# EAGLE design controller_board (EAGLE 7.1.0)
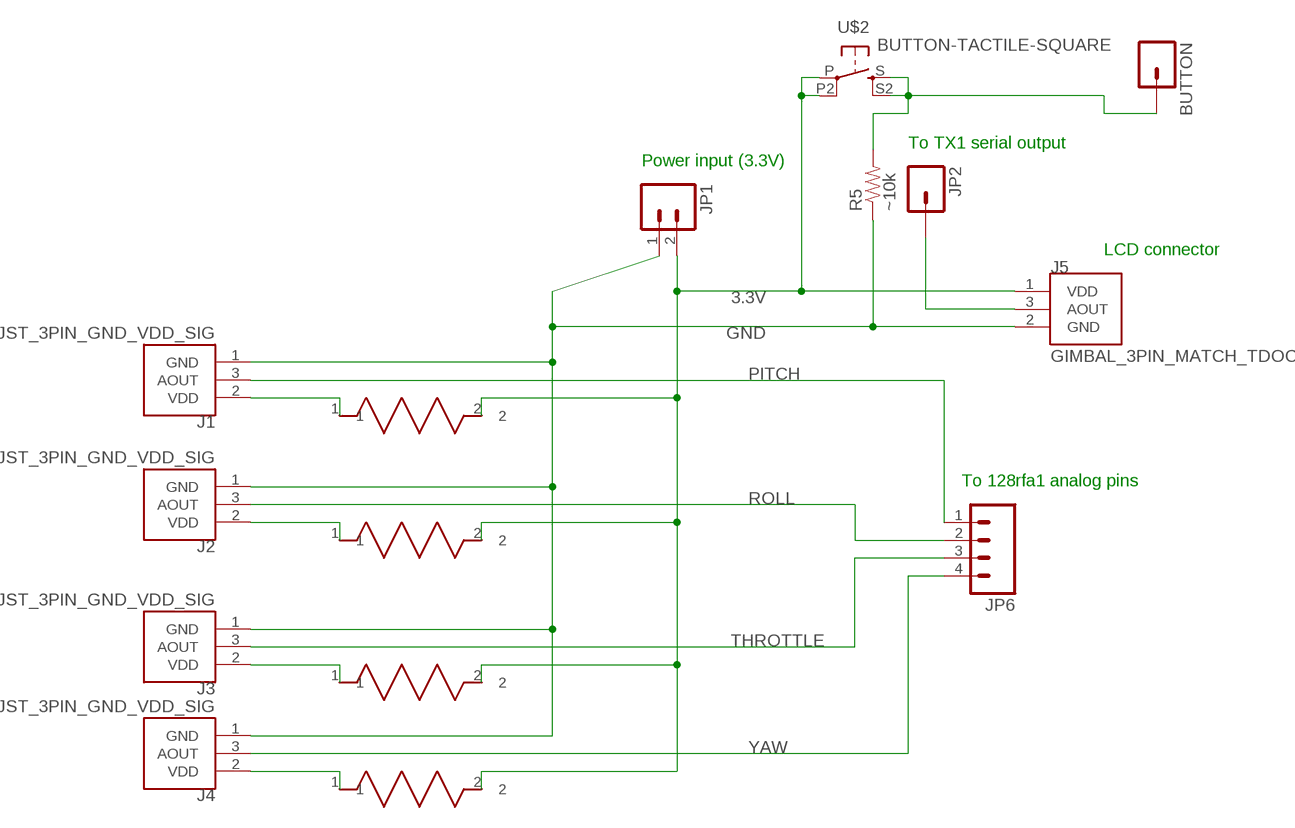
[diagram p0: schematic, sheet 1]

## Parts
BUTTON  M01PTH  [1X01]
J1  JST_3PIN_GND_VDD_SIG  [JST-3-PTH-REVERSE]
J2  JST_3PIN_GND_VDD_SIG  [JST-3-PTH-REVERSE]
J3  JST_3PIN_GND_VDD_SIG  [JST-3-PTH-REVERSE]
J4  JST_3PIN_GND_VDD_SIG  [JST-3-PTH-REVERSE]
J5  GIMBAL_3PIN_MATCH_TDOCU  [JST-3-PTH]
JP1  M021X02_NO_SILK  [1X02_NO_SILK]
JP2  M01PTH  [1X01]
JP6  M04PTH  [1X04]
PITCH  2.5k  RES_CRF12  [RES_CRF12]
R5  ~10k  RESISTORPTH-1/4W  [AXIAL-0.4]
ROLL  2.5k  RES_CRF12  [RES_CRF12]
THROTTLE  2.5k  RES_CRF12  [RES_CRF12]
U$2  BUTTON-TACTILE-SQUARE  [BUTTON-TACTILE-SQUARE-ADAFRUIT1010]
YAW  2.5k  RES_CRF12  [RES_CRF12]

## Nets
3.3V: J5.1(VDD) JP1.2 PITCH.2 ROLL.2 THROTTLE.2 U$2.P U$2.P2(P1) YAW.2
GND: J1.1(GND) J2.1(GND) J3.1(GND) J4.1(GND) J5.2(GND) JP1.1 R5.P$1
N$1: J1.2(VDD) PITCH.1
N$3: J2.2(VDD) ROLL.1
N$4: J3.2(VDD) THROTTLE.1
N$5: J4.2(VDD) YAW.1
N$6: BUTTON.1 R5.P$2 U$2.S U$2.S2(S1)
N$9: J5.3(AOUT) JP2.1
PITCH: J1.3(AOUT) JP6.1
ROLL: J2.3(AOUT) JP6.2
THROTTLE: J3.3(AOUT) JP6.3
YAW: J4.3(AOUT) JP6.4

## Notes on the sheet
- To TX1 serial output
- Power input (3.3V)
- LCD connector
- To 128rfa1 analog pins

## Library data of the parts
BUTTON JP2 = SparkFun-Connectors:M01: Header 1 Standard 1-pin 0.1" header. Use with straight break away headers (SKU : PRT-00116), right angle break away headers (PRT-00553), swiss pins (PRT-00743), machine pins (PRT-00117), and female headers (PRT-00115).
J1-J4 = Controller:JST_3PIN_GND_VDD_SIG
J5 = Controller:GIMBAL_3PIN_MATCH_TDOCU
JP1 = SparkFun-Connectors:M02: Standard 2-pin 0.1" header. Use with - straight break away headers ( PRT-00116) - right angle break away headers (PRT-00553) - swiss pins (PRT-00743) - machine pins (PRT-00117) - female headers (PRT-00115) Molex polarized connector foot print use with: PRT-08233 with associated crimp pins and housings. 2.54_SCREWTERM for use with PRT-10571. 3.5mm Screw Terminal footprints for PRT-08084 5mm Screw Terminal footprints for use with PRT-08432
JP6 = SparkFun-Connectors:M04: Header 4 Standard 4-pin 0.1" header. Use with straight break away headers (SKU : PRT-00116), right angle break away headers (PRT-00553), swiss pins (PRT-00743), machine pins (PRT-00117), and female headers (PRT-00115). Molex polarized connector foot print use with SKU : PRT-08231 with associated crimp pins and housings. 1MM SMD Version SKU: PRT-10208
PITCH ROLL THROTTLE YAW = RyanCollins_Lab4:RES_CRF12
R5 = SparkFun-Resistors:RESISTOR: Resistor Basic schematic elements and footprints for 0603, 1206, and PTH resistors.
U$2 = Controller:BUTTON-TACTILE

## Board
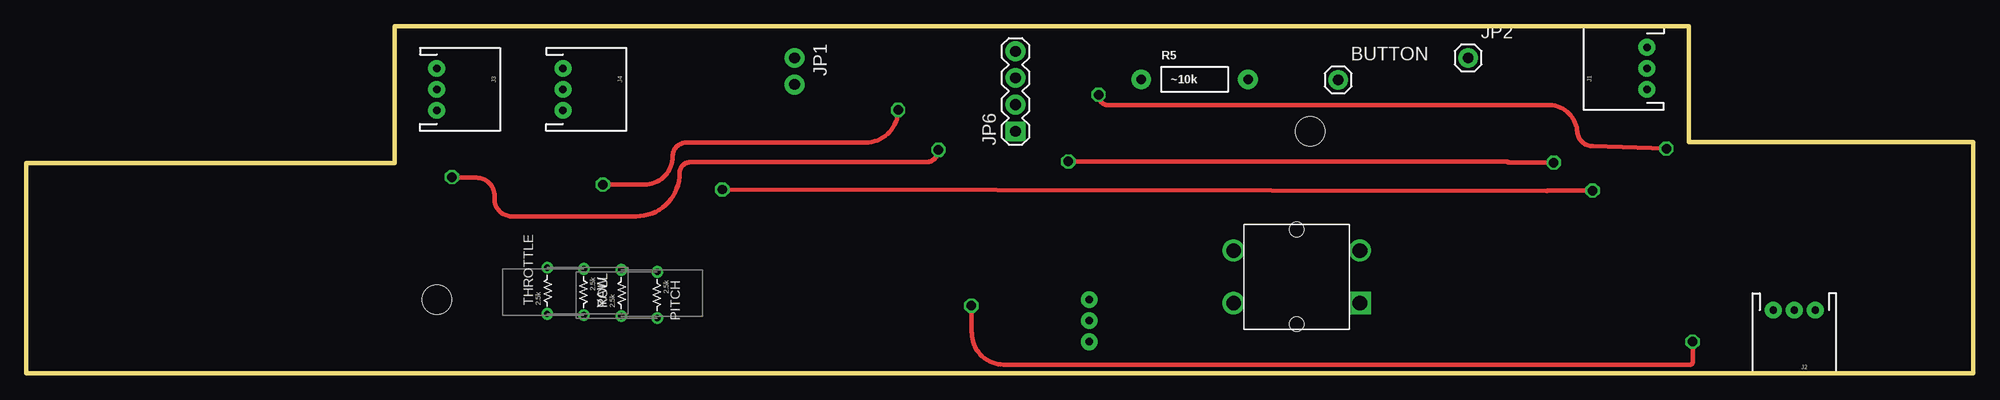
[diagram p1: board, top side]
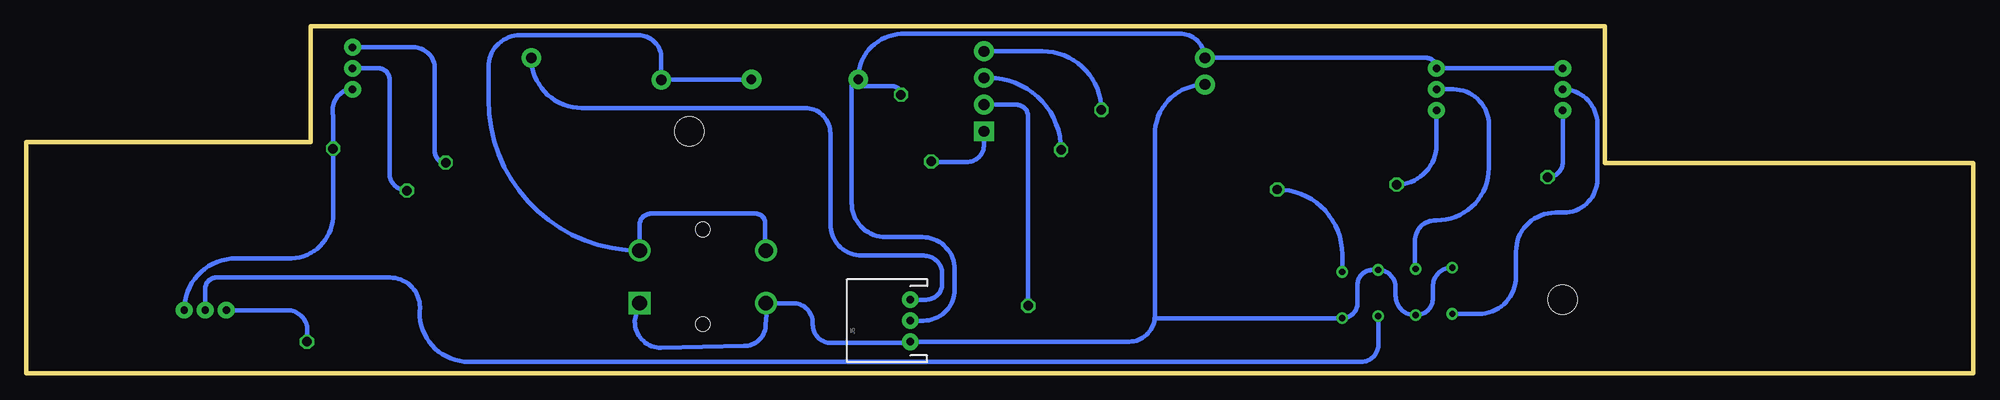
[diagram p2: board, bottom side, seen from below]

Size 185 x 33 mm. Coordinates in mm from the lower left corner, seen from the top.
Outline: 158,22 158,33 35,33 35,20 0,20 0,0 185,0 185,22 158,22
Copper layers (1*16): Top 0.035559375mm / dielectric 1.501140625mm / Bottom 0.035559375mm
Design rules "4pcb-33board *": minimum track width 0.2mm, minimum drill 0.9mm, track to track 12mil, track to pad 12mil, pad to pad 12mil, via to via 12mil, smd to smd 12mil, copper to edge 10mil, drill to drill 10mil, minimum pad ring 10mil, minimum via ring 8mil, stop-mask expansion 4mil, vias tented up to drill 0mil, thermal gap 10mil

### Footprints (pad centres in the part's own frame; a part is rotated, then mirrored left to right if it is on the bottom)
1X01 = drill 1.016 pad 1.88: 1 0,0
JST-3-PTH-REVERSE = drill 0.7 pad 1.6: 1 -2,0; 2 0,0; 3 2,0
JST-3-PTH = drill 0.7 pad 1.6: 1 -2,0; 2 0,0; 3 2,0
1X02_NO_SILK = drill 1.016 pad 1.88: 1 0,0; 2 2.54,0
1X04 = drill 1.016 pad 1.88 square: 1 0,0 | drill 1.016 pad 1.88: 2 2.54,0; 3 5.08,0; 4 7.62,0
RES_CRF12 = drill 0.6: 1 -2.2,0; 2 2.2,0
AXIAL-0.4 = drill 0.9 pad 1.88: P$1 -5.08,0; P$2 5.08,0
CONNECTOR_BOARD_OUTLINE = hole 2.8: 154,45; 71,29
BUTTON-TACTILE-SQUARE-ADAFRUIT1010 = drill 1.4 square: P -6,2.5 | drill 1.4: P2 6,2.5; S -6,-2.5; S2 6,-2.5 | hole 1.4: 0,-4.5; 0,4.5

### Placement (x,y rotation side)
BUTTON  124.66,27.9 0 top
J1  154,29 90 top
J2  168,6 180 top
J3  39,27 270 top
J4  51,27 270 top
J5  101,5 90 bottom
JP1  73,30 270 top
JP2  137,30 0 top
JP6  94,23 90 top
PITCH  59.96,7.44 270 top
R5  111.01,27.94 0 top
ROLL  56.54,7.62 90 top
THROTTLE  49.5,7.84 90 top
U$1  [CONNECTOR_BOARD_OUTLINE]  -32,-22 0 top
U$2  120.72,9.17 180 top
YAW  52.98,7.71 270 top

### Tracks (layer width: path | path; a pad name or v marks a point on that pad's centre or on a via)
3.3V
  Bottom 0.406: 77.77,5.43 arc90 80.2,3 J5.1 arc90 101.12,2.88 108.52,2.88 arc90 110.27,4.62 110.27,4.78 arc-90 112.16,6.67 U$2.P2 arc90 114.55,6.5 114.74,4.65 arc90 116.8,2.59 124.67,2.4 arc90 127.19,4.92 126.84,6.54 arc90 U$2.P | 77.77,5.43 77.77,22.7 arc90 JP1.2 | THROTTLE.2 49.55,10.04 arc-90 51.35,8.25 51.35,7.14 arc90 YAW.2 53.03,5.51 arc90 54.88,7.37 54.88,8.16 arc-90 ROLL.2 57.08,9.82 arc-90 58.5,8.4 58.5,6.7 arc90 PITCH.2 77.57,5.24 arc90 77.77,5.43
GND  (via drill 0.9)
  Top 0.406: v101.89,26.49 101.89,26.42 arc90 102.81,25.5 144.27,25.5 arc-90 147.36,23.11 arc90 148.88,21.59 v155.85,21.36
  Bottom 0.406: J5.2 99.75,5 arc-90 96.78,7.96 96.78,9.87 arc-90 99.86,12.94 103.33,12.94 arc90 106.57,16.18 106.57,27.31 | 106.57,27.31 arc90 R5.P$1 105.93,28.24 arc90 101.48,32.28 75.39,32.28 arc90 JP1.1 52,30 arc90 J4.1 J3.1 | J1.1 154.37,27 arc-90 155.84,24.51 v155.85,21.36 155.86,15.16 arc90 159.78,10.92 165.07,10.92 arc-90 J2.1 | 106.57,27.31 102.71,27.31 arc90 v101.89,26.49
N$1  (via drill 0.9)
  Top 0.406: v66.13,17.47 144.44,17.35 arc-90 144.52,17.32 arc-90 144.58,17.37 v148.83,17.37
  Bottom 0.406: J1.2 151.52,29 arc90 150.49,27.97 150.49,19.03 arc-90 v148.83,17.37 | PITCH.1 59.96,11.3 arc-90 v66.13,17.47
N$3
  Bottom 0.406: J2.2 168,8.04 arc90 166.93,9.1 150.43,9.1 arc90 147.6,6.27 arc-90 143.41,1.1 58.44,1.08 arc-90 56.54,2.52 ROLL.1
N$4
  Bottom 0.406: THROTTLE.1 46.99,5.64 arc-90 43.45,9.18 43.45,11.55 arc90 39.72,15.27 38.91,15.27 arc-90 35.72,18.46 35.72,23.72 arc-90 J3.2
N$5
  Bottom 0.406: J4.2 49.38,27 arc90 46.02,23.64 46.02,19.52 arc90 51.01,14.54 51.12,14.54 arc-90 53.04,12.62 53.04,9.98 arc-90 YAW.1
N$6
  Bottom 0.406: U$2.S2 arc90 114.78,11.73 114.78,14.26 arc-90 115.69,15.18 125.65,15.18 arc-90 126.72,14.1 U$2.S arc90 141.09,26.03 141.09,29.14 arc90 138.07,32.16 126.84,32.16 arc90 124.66,29.97 BUTTON.1 arc90 124.62,27.94 R5.P$2
N$9
  Bottom 0.406: J5.3 99.47,7 arc-90 97.97,8.5 97.97,9.43 arc-90 99.72,11.19 105.58,11.19 arc90 108.6,14.2 108.6,22.82 arc-90 111.01,25.23 132.23,25.23 arc90 JP2.1
PITCH  (via drill 0.9)
  Top 0.406: v99.01,20.14 140.77,20.14 arc90 140.88,20.03 v145.14,20.03
  Bottom 0.406: J1.3 148.21,31 arc90 146.18,28.98 146.18,21.07 arc-90 v145.14,20.03 | JP6.1 94,21.73 arc90 95.65,20.09 98.97,20.09 arc90 v99.01,20.14
ROLL  (via drill 0.9)
  Top 0.406: v158.34,2.99 158.34,1.05 arc-90 158.1,0.82 92.87,0.82 arc-90 89.85,3.84 arc-90 89.8,3.89 v89.8,6.42
  Bottom 0.406: JP6.2 90.92,25.54 arc90 89.81,24.44 89.81,6.43 arc-90 v89.8,6.42 | J2.3 160.2,6 arc90 158.3,4.1 158.3,3.03 arc90 v158.34,2.99
THROTTLE  (via drill 0.9)
  Top 0.406: v40.44,18.65 arc90 40.49,18.6 42.79,18.6 arc-90 44.49,16.9 44.49,16.57 arc90 46.14,14.92 57.96,14.92 arc90 62.08,19.03 arc-90 63.12,20.08 85.5,20.08 arc90 v86.68,21.25
  Bottom 0.406: J3.3 39,20.09 arc90 v40.44,18.65 | JP6.3 93.5,28.08 arc90 v86.68,21.25
YAW  (via drill 0.9)
  Top 0.406: v54.79,17.94 58.73,17.94 arc90 61.42,20.62 arc-90 62.74,21.94 79.75,21.94 arc90 v82.84,25.04
  Bottom 0.406: J4.3 51,21.73 arc90 v54.79,17.94 | JP6.4 88.42,30.62 arc90 v82.84,25.04